# EAGLE schematic test (EAGLE 7.2.0)
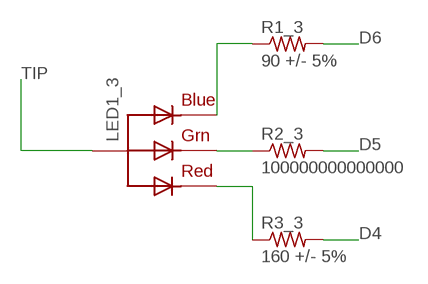
[diagram p0: schematic, sheet 1]

## Parts
LED1_3  RGBLED_CA-5MM  [LED5MMRGB]
R1_3  90 +/- 5%  GENERIC-RESISTOR_1608-0603_CERAMIC  [RESC1608X55HS]
R2_3  100000000000000  GENERIC-RESISTOR_1608-0603_CERAMIC  [RESC1608X55HS]
R3_3  160 +/- 5%  GENERIC-RESISTOR_1608-0603_CERAMIC  [RESC1608X55HS]

## Nets
D4: R3_3.2
D5: R2_3.2
D6: R1_3.2
N$1_3: LED1_3.4(BLUE) R1_3.1
N$2_3: LED1_3.3(GREEN) R2_3.1
N$3_3: LED1_3.1(RED) R3_3.1
TIP: LED1_3.2(VCC)

## Library data of the parts
LED1_3 = Components:RGBLED_CA: RGB LED, common-anode 5MM Staggered pins 5mm Piranha package http://www.ladyada.net/library/pcb/eaglelibrary.html; CREATOR: Swanson
R1_3 R2_3 R3_3 = NVSL:GENERIC-RESISTOR_: Generic resistor